# EAGLE design ATMEGA328PB_EVAL (EAGLE 9.6.2)
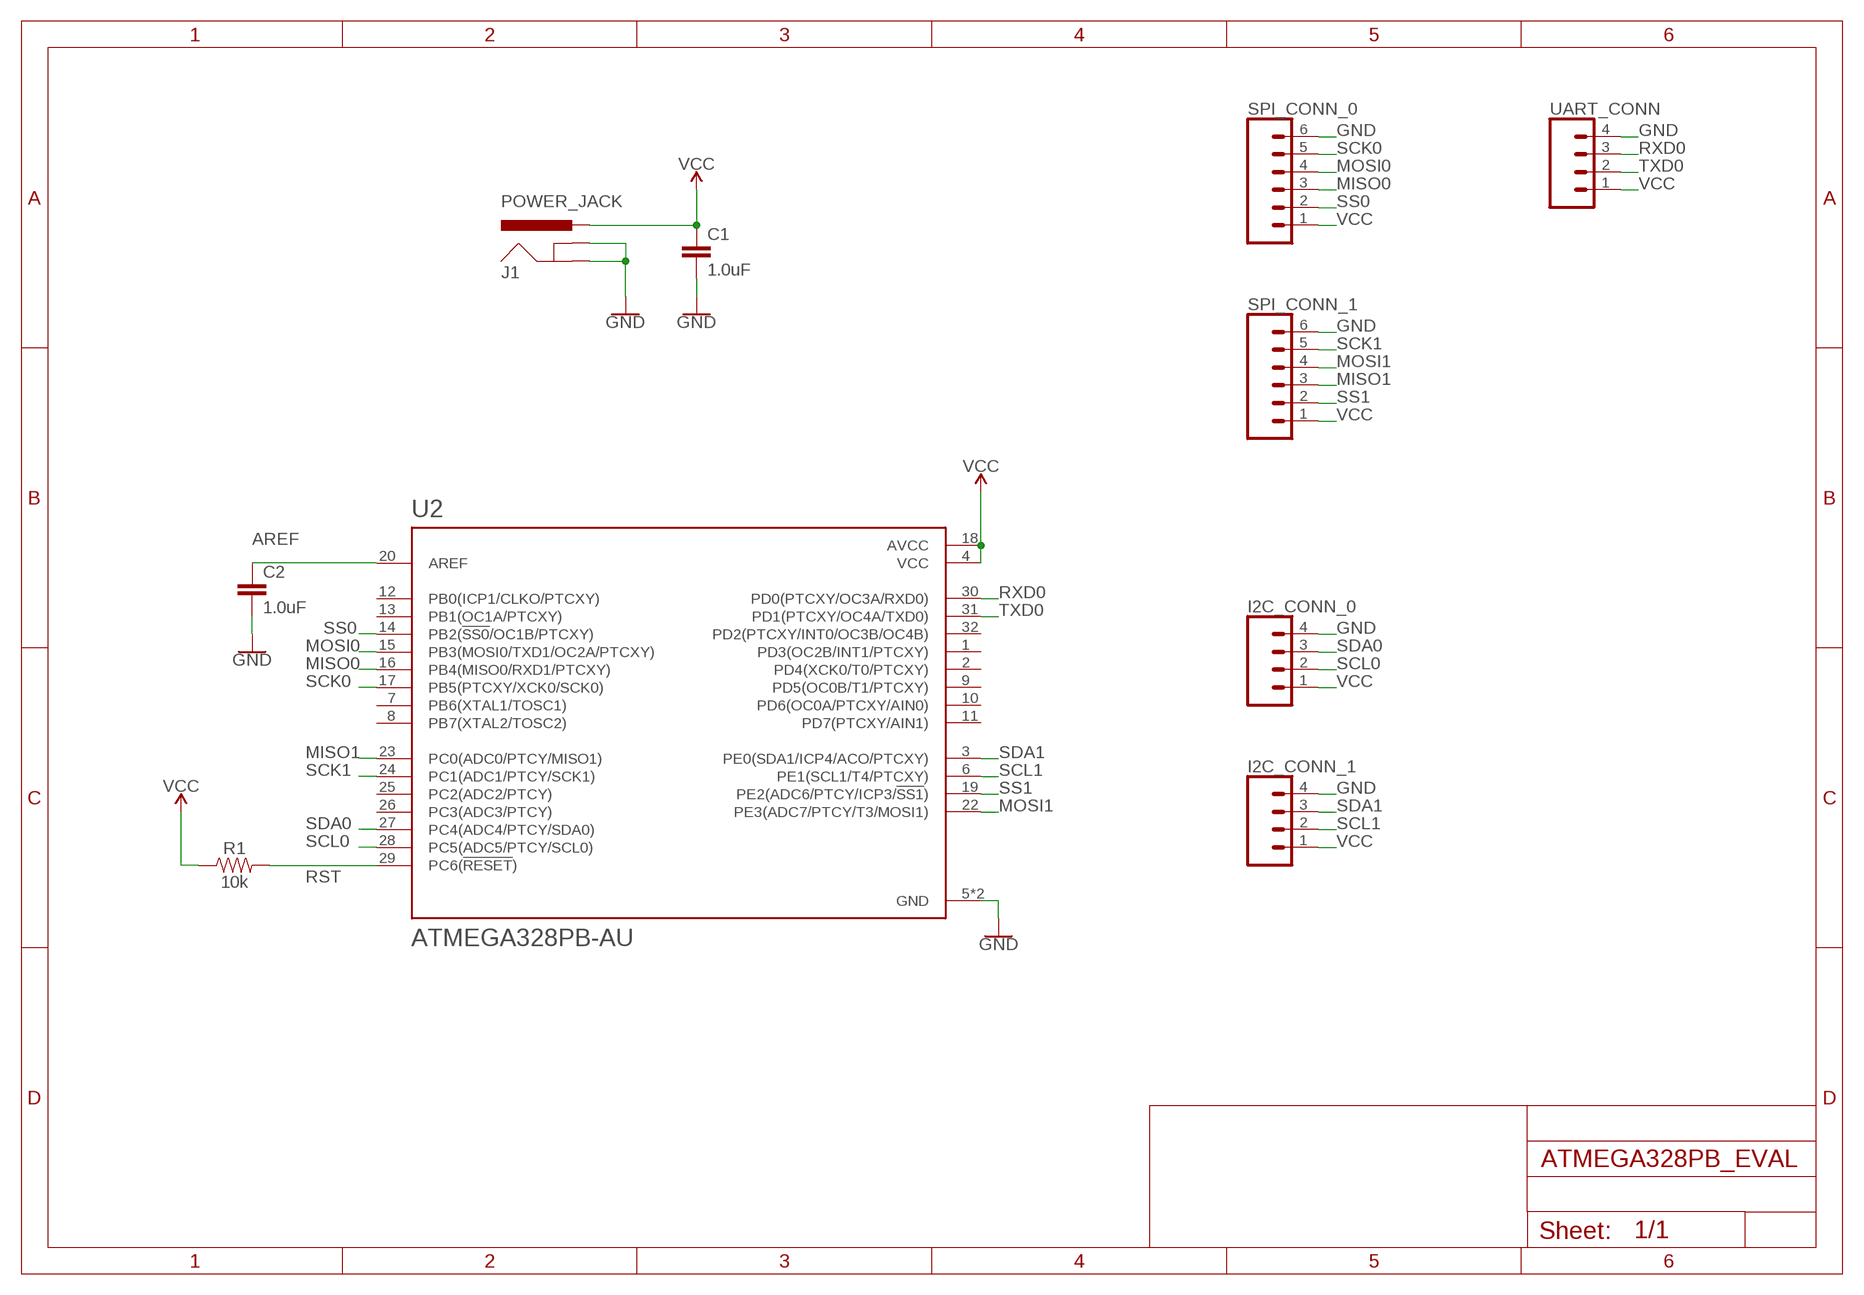
[diagram p0: schematic, sheet 1]

## Parts
C1  1.0uF  1.0UF-0603-16V-10%  [0603]
C2  1.0uF  1.0UF-0603-16V-10%  [0603]
I2C_CONN_0  CONN_04  [1X04]
I2C_CONN_1  CONN_04  [1X04]
J1  POWER_JACK  [POWER_JACK_PTH]
R1  10k  10KOHM-0603-1/10W-1%  [0603]
SPI_CONN_0  CONN_06SILK_FEMALE_PTH  [1X06]
SPI_CONN_1  CONN_06SILK_FEMALE_PTH  [1X06]
U2  ATMEGA328PB-AU  [QFP80P900X900X120-32N]
UART_CONN  CONN_04  [1X04]

## Nets
AREF: C2.1 U2.20(AREF)
GND: C1.2 C2.2 I2C_CONN_0.4 I2C_CONN_1.4 J1.GND J1.GNDBREAK SPI_CONN_0.6 SPI_CONN_1.6 U2.5(GND) U2.21(GND) UART_CONN.4
MISO0: SPI_CONN_0.3 U2.16(PB4(MISO0/RXD1/PTCXY))
MISO1: SPI_CONN_1.3 U2.23(PC0(ADC0/PTCY/MISO1))
MOSI0: SPI_CONN_0.4 U2.15(PB3(MOSI0/TXD1/OC2A/PTCXY))
MOSI1: SPI_CONN_1.4 U2.22(PE3(ADC7/PTCY/T3/MOSI1))
RST: R1.2 U2.29(PC6(!RESET!))
RXD0: U2.30(PD0(PTCXY/OC3A/RXD0)) UART_CONN.3
SCK0: SPI_CONN_0.5 U2.17(PB5(PTCXY/XCK0/SCK0))
SCK1: SPI_CONN_1.5 U2.24(PC1(ADC1/PTCY/SCK1))
SCL0: I2C_CONN_0.2 U2.28(PC5(ADC5/PTCY/SCL0))
SCL1: I2C_CONN_1.2 U2.6(PE1(SCL1/T4/PTCXY))
SDA0: I2C_CONN_0.3 U2.27(PC4(ADC4/PTCY/SDA0))
SDA1: I2C_CONN_1.3 U2.3(PE0(SDA1/ICP4/ACO/PTCXY))
SS0: SPI_CONN_0.2 U2.14(PB2(!SS0!/OC1B/PTCXY))
SS1: SPI_CONN_1.2 U2.19(PE2(ADC6/PTCY/ICP3/!SS1!))
TXD0: U2.31(PD1(PTCXY/OC4A/TXD0)) UART_CONN.2
VCC: C1.1 I2C_CONN_0.1 I2C_CONN_1.1 J1.PWR R1.1 SPI_CONN_0.1 SPI_CONN_1.1 U2.4(VCC) U2.18(AVCC) UART_CONN.1
Unconnected: U2.1(PD3(OC2B/INT1/PTCXY)) U2.2(PD4(XCK0/T0/PTCXY)) U2.7(PB6(XTAL1/TOSC1)) U2.8(PB7(XTAL2/TOSC2)) U2.9(PD5(OC0B/T1/PTCXY)) U2.10(PD6(OC0A/PTCXY/AIN0)) U2.11(PD7(PTCXY/AIN1)) U2.12(PB0(ICP1/CLKO/PTCXY)) U2.13(PB1(OC1A/PTCXY)) U2.25(PC2(ADC2/PTCY)) U2.26(PC3(ADC3/PTCY)) U2.32(PD2(PTCXY/INT0/OC3B/OC4B))

## Library data of the parts
C1 C2 = SparkFun-Capacitors:1.0UF: 1µF ceramic capacitors A capacitor is a passive two-terminal electrical component used to store electrical energy temporarily in an electric field.; PROD_ID: CAP-00868
I2C_CONN_0 I2C_CONN_1 UART_CONN = SparkFun-Connectors:CONN_04: Multi connection point. Often used as Generic Header-pin footprint for 0.1 inch spaced/style header connections On any of the 0.1 inch spaced packages, you can populate with these: Break Away Headers - Straight <https://www.sparkfun.com/products/116> (PRT-00116) Break Away Male Headers - Right Angle <https://www.sparkfun.com/products/553> (PRT-00553) Female Headers <https://www.sparkfun.com/products/115> (PRT-00115) Break Away Headers - Machine Pin <https://www.sparkfun.com/products/117> (PRT-00117) Break Away Female Headers - Swiss Machine Pin <https://www.sparkfun.com/products/743> (PRT-00743) For SCREWTERMINALS and SPRING TERMINALS visit here: Screw Terimnals on SparkFun.com <https://www.sparkfun.com/search/results?term=Screw+Terminals> (5mm/3.5mm/2.54mm spacing) This device is also useful as a general connection point to wire up your design to another part of your project. Our various solder wires solder well into these plated through hole pads. Hook-Up Wire - Assortment (Stranded, 22 AWG) <https://www.sparkfun.com/products/11375> (PRT-11375) Hook-Up Wire - Assortment (Solid Core, 22 AWG) <https://www.sparkfun.com/products/11367> (PRT-11367) View the entire wire category on our website here <https://www.sparkfun.com/categories/141> Special notes: Molex polarized connector foot print use with SKU : PRT-08231 with associated crimp pins and housings. 1MM SMD Version SKU: PRT-10208; PROD_ID: CONN-09696
J1 = SparkFun-Connectors:POWER_JACK: Power Jack Connector This is the standard 5.5mm barrel jack for power. The PTH is the most common, proven, reliable, footprint. The Slot footprint only works if the mill layer is transmitted to the PCB fab house so be warned. Here are the connectors we sell at SparkFun: DC Barrel Power Jack/Connector <https://www.sparkfun.com/products/119> (PRT-00119) DC Barrel Power Jack/Connector (SMD) <https://www.sparkfun.com/products/12748> (PRT-12748) DC Barrel Jack Adapter - Breadboard Compatible <https://www.sparkfun.com/products/10811> (PRT-10811) It is used on this SparkFun product (and many, many others): SparkFun RedBoard - Programmed with Arduino <https://www.sparkfun.com/products/12757> (DEV-12757) Also, if you need a mating power supply or connector, please check these out: Wall Adapter Power Supply - 9VDC 650mA <https://www.sparkfun.com/products/298> (TOL-00298) DC Barrel Jack Adapter - Male <https://www.sparkfun.com/products/10287> (PRT-10287); PROD_ID: CONN-08197
R1 = SparkFun-Resistors:10KOHM: 10kΩ resistor A resistor is a passive two-terminal electrical component that implements electrical resistance as a circuit element. Resistors act to reduce current flow, and, at the same time, act to lower voltage levels within circuits. - Wikipedia; PROD_ID: RES-00824
SPI_CONN_0 SPI_CONN_1 = SparkFun-Connectors:CONN_06: Multi connection point. Often used as Generic Header-pin footprint for 0.1 inch spaced/style header connections On any of the 0.1 inch spaced packages, you can populate with these: Break Away Headers - Straight <https://www.sparkfun.com/products/116> (PRT-00116) Break Away Male Headers - Right Angle <https://www.sparkfun.com/products/553> (PRT-00553) Female Headers <https://www.sparkfun.com/products/115> (PRT-00115) Break Away Headers - Machine Pin <https://www.sparkfun.com/products/117> (PRT-00117) Break Away Female Headers - Swiss Machine Pin <https://www.sparkfun.com/products/743> (PRT-00743) Arduino Stackable Header - 6 Pin <https://www.sparkfun.com/products/9280> (PRT-09280) For SCREWTERMINALS and SPRING TERMINALS visit here: Screw Terimnals on SparkFun.com <https://www.sparkfun.com/search/results?term=Screw+Terminals> (5mm/3.5mm/2.54mm spacing) This device is also useful as a general connection point to wire up your design to another part of your project. Our various solder wires solder well into these plated through hole pads. Hook-Up Wire - Assortment (Stranded, 22 AWG) <https://www.sparkfun.com/products/11375> (PRT-11375) Hook-Up Wire - Assortment (Solid Core, 22 AWG) <https://www.sparkfun.com/products/11367> (PRT-11367) View the entire wire category on our website here <https://www.sparkfun.com/categories/141>; PROD_ID: CONN-08437
U2 = ATMEGA328PB-AU:ATMEGA328PB-AU: ATmega Series 20 MHz 32 KB Flash 2 KB SRAM 8-Bit Microcontroller - TQFP-32 Check prices <https://pricing.snapeda.com/parts/ATMEGA328PB-AU/Microchip%20Technology%20/%20Atmel/view-part?ref=eda>; AVAILABILITY: Not in stock; DESCRIPTION: AVR AVR® ATmega, Functional Safety (FuSa) Microcontroller IC 8-Bit 20MHz 32KB (16K x 16) FLASH 32-TQFP (7x7); MF: Microchip Technology / Atmel; MP: ATMEGA328PB-AU; PACKAGE: TQFP-32 Microchip Technology / Atmel; PRICE: None

## Board
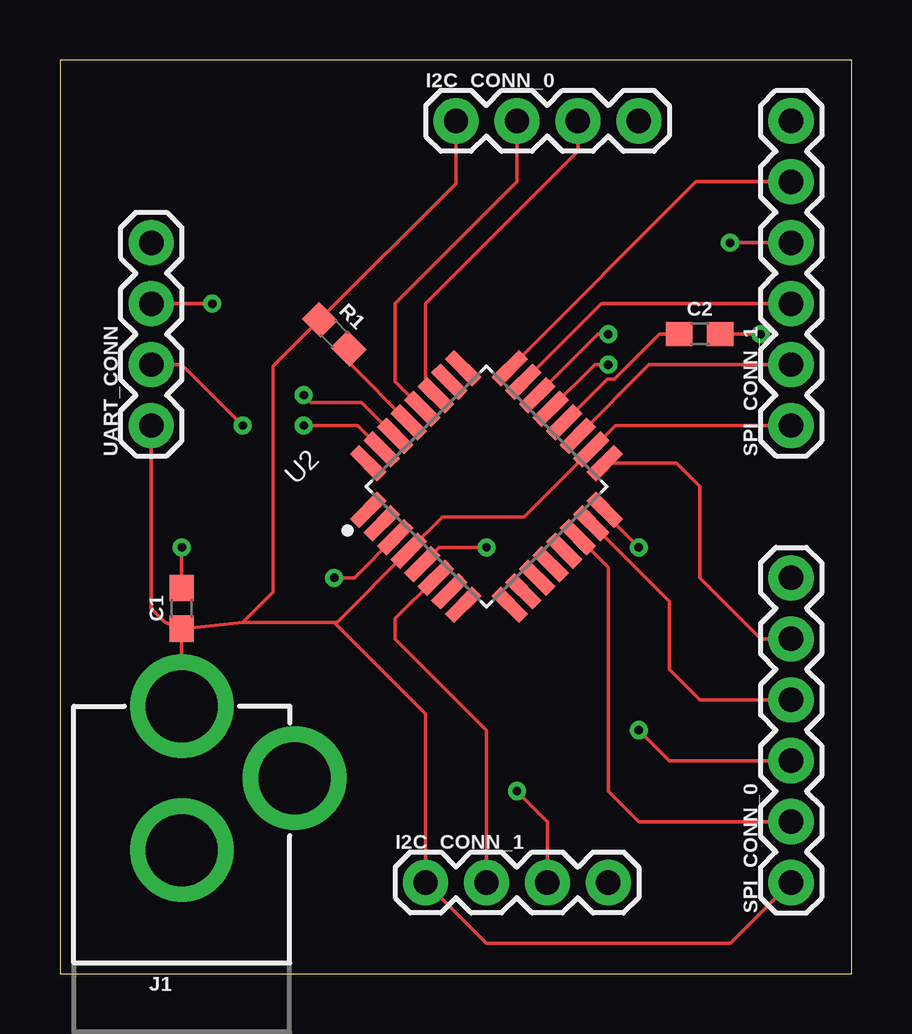
[diagram p1: board, top side]
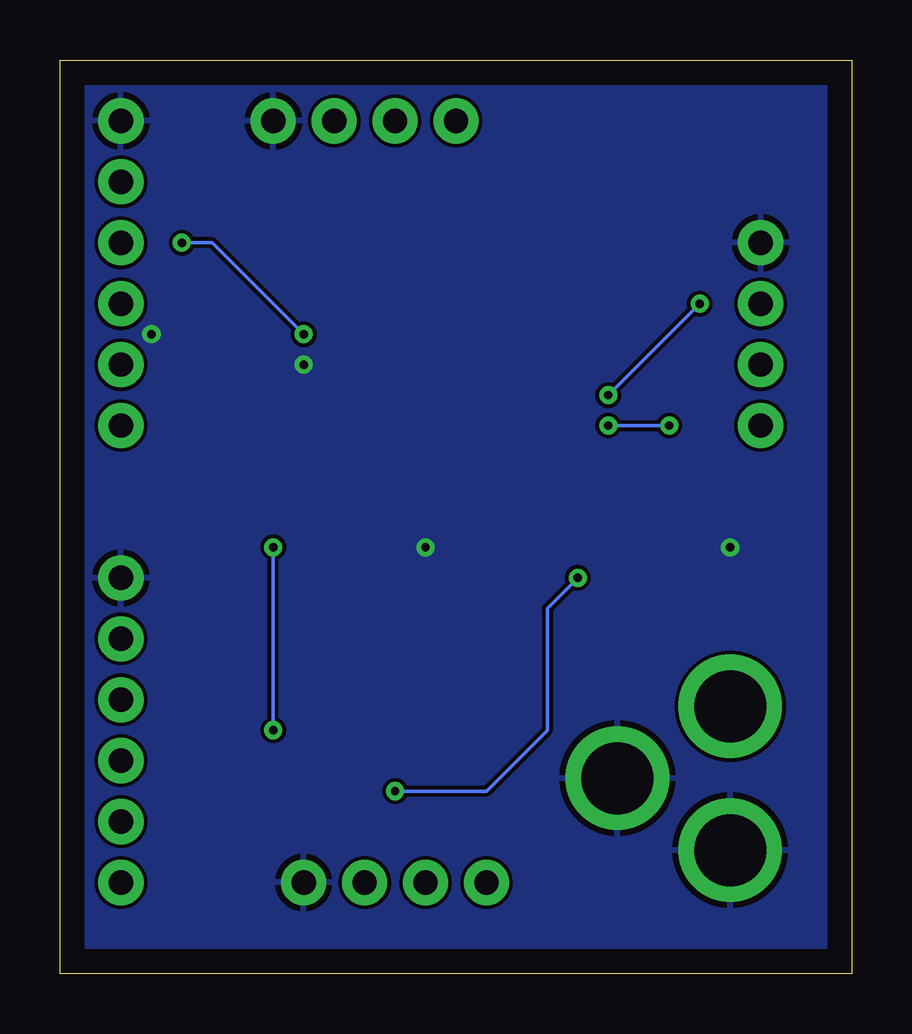
[diagram p2: board, bottom side, seen from below]

Size 33.02 x 38.1 mm. Coordinates in mm from the lower left corner, seen from the top.
Outline: 0,0 33.02,0 33.02,38.1 0,38.1 0,0
Copper layers (1*16): Top 0.035mm / dielectric 1.5mm / Bottom 0.035mm
Design rules "default": minimum track width 6mil, minimum drill 0.35mm, track to track 6mil, track to pad 6mil, pad to pad 6mil, via to via 6mil, smd to smd 6mil, copper to edge 40mil, drill to drill 6mil, minimum pad ring 10mil, minimum via ring 8mil, stop-mask expansion 4mil, vias tented up to drill 0mil, thermal gap 10mil

### Footprints (pad centres in the part's own frame; a part is rotated, then mirrored left to right if it is on the bottom)
0603 = smd 1.1 x 1: 1 -0.85,0; 2 0.85,0
1X04 = drill 1.016 pad 1.88: 1 0,0; 2 2.54,0; 3 5.08,0; 4 7.62,0
POWER_JACK_PTH = drill 2.997 pad 4.318: GND 0,7.7; GNDBREAK 4.7,10.7; PWR 0,13.7
1X06 = drill 1.016 pad 1.88: 1 0,0; 2 2.54,0; 3 5.08,0; 4 7.62,0; 5 10.16,0; 6 12.7,0
QFP80P900X900X120-32N = smd 1.6 x 0.55: 1 -4.18,2.8; 2 -4.18,2; 3 -4.18,1.2; 4 -4.18,0.4; 5 -4.18,-0.4; 6 -4.18,-1.2; 7 -4.18,-2; 8 -4.18,-2.8; 17 4.18,-2.8; 18 4.18,-2; 19 4.18,-1.2; 20 4.18,-0.4; 21 4.18,0.4; 22 4.18,1.2; 23 4.18,2; 24 4.18,2.8 | smd 0.55 x 1.6: 9 -2.8,-4.18; 10 -2,-4.18; 11 -1.2,-4.18; 12 -0.4,-4.18; 13 0.4,-4.18; 14 1.2,-4.18; 15 2,-4.18; 16 2.8,-4.18; 25 2.8,4.18; 26 2,4.18; 27 1.2,4.18; 28 0.4,4.18; 29 -0.4,4.18; 30 -1.2,4.18; 31 -2,4.18; 32 -2.8,4.18

### Placement (x,y rotation side)
C1  5.08,15.24 90 top
C2  26.67,26.67 0 top
I2C_CONN_0  16.51,35.56 0 top
I2C_CONN_1  15.24,3.81 0 top
J1  5.08,-2.54 0 top
R1  11.43,26.67 315 top
SPI_CONN_0  30.48,3.81 90 top
SPI_CONN_1  30.48,22.86 90 top
U2  17.78,20.32 45 top
UART_CONN  3.81,22.86 90 top

### Tracks (layer width: path | path; a pad name or v marks a point on that pad's centre or on a via)
AREF
  Top 0.152: U2.20 22.82,24.79 23.11,24.79 24.99,26.67 C2.1
GND  (via drill 0.35)
  Top 0.152: C1.2 v5.08,17.78 | U2.5 15.81,17.78 v17.78,17.78 | U2.21 22.29,25.4 v22.86,25.4 | C2.2 v29.21,26.67
  pour Bottom: 0,0 0,38.1 33.02,38.1 33.02,0
MISO0  (via drill 0.35)
  Top 0.152: SPI_CONN_0.3 25.4,8.89 v24.13,10.16 | v24.13,17.78 22.72,19.19 U2.16
  Bottom 0.152: v24.13,10.16 v24.13,17.78
MISO1
  Top 0.152: U2.23 22.57,27.94 SPI_CONN_1.3
MOSI0
  Top 0.152: U2.15 25.4,15.53 25.4,12.7 26.67,11.43 SPI_CONN_0.4
MOSI1  (via drill 0.35)
  Top 0.152: U2.22 22.43,26.67 v22.86,26.67 | v27.94,30.48 SPI_CONN_1.4
  Bottom 0.152: v27.94,30.48 26.67,30.48 v22.86,26.67
RST
  Top 0.152: U2.29 12.03,25.5 R1.2
RXD0  (via drill 0.35)
  Top 0.152: v6.35,27.94 UART_CONN.3 | U2.30 12.57,23.83 11.43,23.83 10.46,23.83 v10.16,24.13
  Bottom 0.152: v10.16,24.13 v6.35,27.94
SCK0
  Top 0.152: U2.17 25.69,21.3 26.67,20.32 26.67,16.51 29.21,13.97 SPI_CONN_0.5
SCK1
  Top 0.152: U2.24 26.52,33.02 SPI_CONN_1.5
SCL0
  Top 0.152: U2.28 13.97,24.7 13.97,27.94 19.05,33.02 I2C_CONN_0.2
SCL1
  Top 0.152: U2.6 13.97,14.81 13.97,13.97 17.78,10.16 I2C_CONN_1.2
SDA0
  Top 0.152: U2.27 15.24,24.56 15.24,27.94 21.59,34.29 I2C_CONN_0.3
SDA1  (via drill 0.35)
  Top 0.152: U2.3 12.27,16.51 v11.43,16.51 | v19.05,7.62 20.32,6.35 I2C_CONN_1.3
  Bottom 0.152: v11.43,16.51 12.7,15.24 12.7,10.16 15.24,7.62 v19.05,7.62
SS0
  Top 0.152: U2.14 22.86,16.94 22.86,7.62 24.13,6.35 SPI_CONN_0.2
SS1
  Top 0.152: U2.19 24.56,25.4 SPI_CONN_1.2
TXD0  (via drill 0.35)
  Top 0.152: U2.31 12.41,22.86 v10.16,22.86 | v7.62,22.86 5.08,25.4 UART_CONN.2
  Bottom 0.152: v10.16,22.86 v7.62,22.86
VCC
  Top 0.152: C1.1 J1.PWR | C1.1 4.39,14.66 3.81,15.24 UART_CONN.1 | 11.43,14.66 11.55,14.66 U2.4 15.94,19.05 19.34,19.05 U2.18 23.15,22.86 SPI_CONN_1.1 | 11.43,14.66 7.62,14.66 | 7.62,14.66 C1.1 | 11.43,14.66 15.24,10.85 I2C_CONN_1.1 17.78,1.27 27.94,1.27 SPI_CONN_0.1 | 7.62,14.66 8.89,15.93 8.89,25.33 R1.1 16.51,32.95 I2C_CONN_0.1